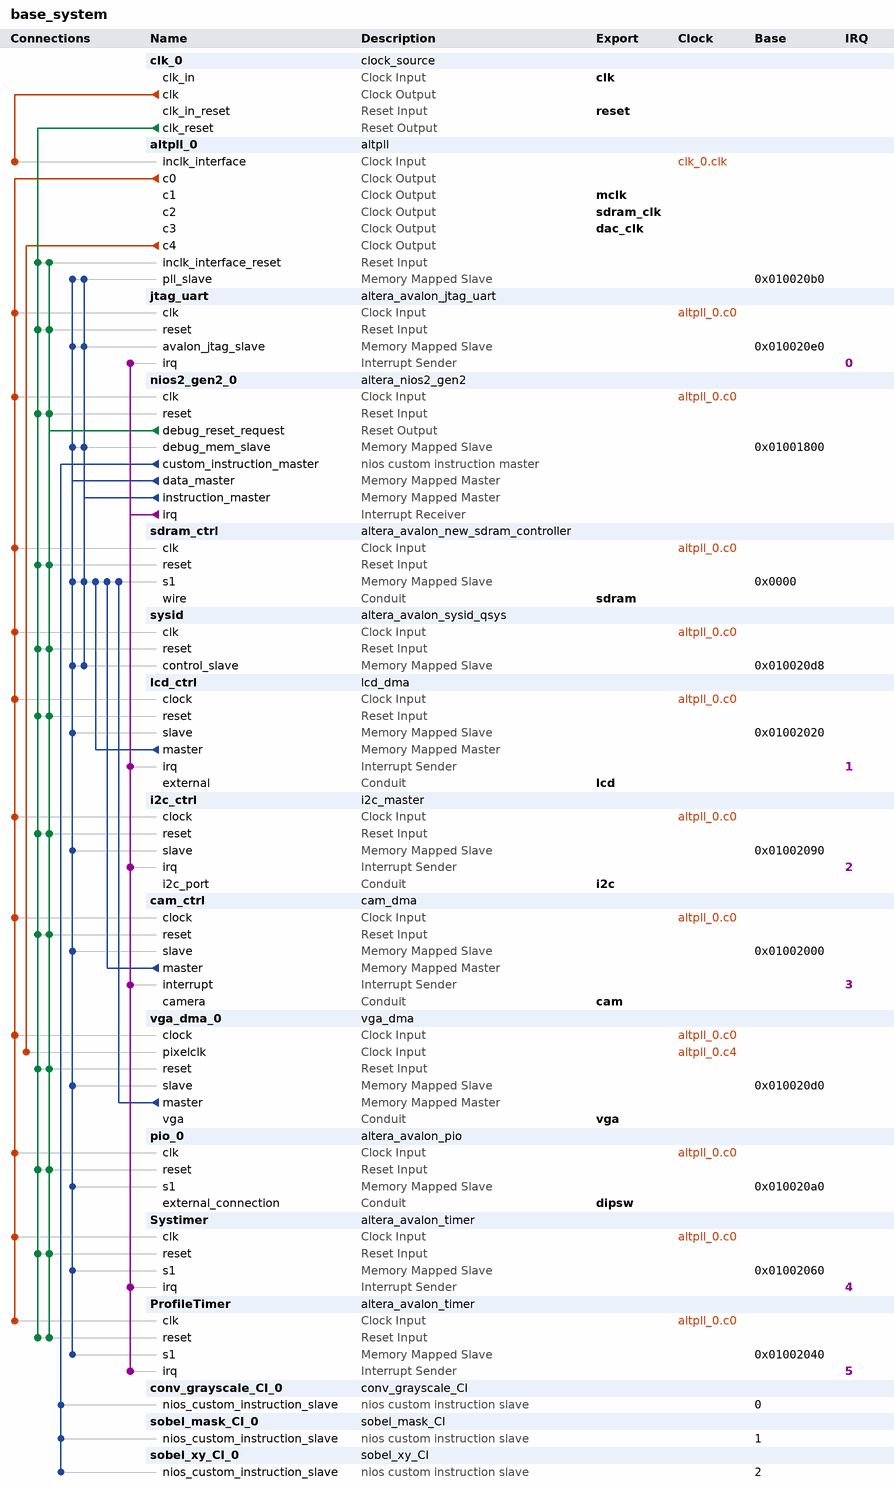
[diagram p0: system contents]
# Platform Designer (Qsys) system base_system, Cyclone IV E EP4CE30F23C7
# Parameters at their usual value, and those the tool derives, are not listed.
package require -exact qsys 18.1
create_system base_system
set_project_property DEVICE_FAMILY {Cyclone IV E}
set_project_property DEVICE EP4CE30F23C7

add_instance clk_0 clock_source 18.1
set_instance_parameter_value clk_0 clockFrequency 50000000

add_instance altpll_0 altpll 18.1
set_instance_parameter_value altpll_0 CLK0_DIVIDE_BY 1
set_instance_parameter_value altpll_0 CLK0_MULTIPLY_BY 1
set_instance_parameter_value altpll_0 CLK1_DIVIDE_BY 25
set_instance_parameter_value altpll_0 CLK1_DUTY_CYCLE 50
set_instance_parameter_value altpll_0 CLK1_MULTIPLY_BY 8
set_instance_parameter_value altpll_0 CLK1_PHASE_SHIFT 0
set_instance_parameter_value altpll_0 CLK2_DIVIDE_BY 1
set_instance_parameter_value altpll_0 CLK2_DUTY_CYCLE 50
set_instance_parameter_value altpll_0 CLK2_MULTIPLY_BY 1
set_instance_parameter_value altpll_0 CLK2_PHASE_SHIFT 0
set_instance_parameter_value altpll_0 CLK3_DIVIDE_BY 2
set_instance_parameter_value altpll_0 CLK3_DUTY_CYCLE 50
set_instance_parameter_value altpll_0 CLK3_MULTIPLY_BY 3
set_instance_parameter_value altpll_0 CLK3_PHASE_SHIFT 0
set_instance_parameter_value altpll_0 CLK4_DIVIDE_BY 2
set_instance_parameter_value altpll_0 CLK4_DUTY_CYCLE 50
set_instance_parameter_value altpll_0 CLK4_MULTIPLY_BY 3
set_instance_parameter_value altpll_0 CLK4_PHASE_SHIFT 0
set_instance_parameter_value altpll_0 INCLK0_INPUT_FREQUENCY 20000
set_instance_parameter_value altpll_0 PORT_ARESET PORT_UNUSED
set_instance_parameter_value altpll_0 PORT_LOCKED PORT_UNUSED
set_instance_parameter_value altpll_0 PORT_clk1 PORT_USED
set_instance_parameter_value altpll_0 PORT_clk2 PORT_USED
set_instance_parameter_value altpll_0 PORT_clk3 PORT_USED
set_instance_parameter_value altpll_0 PORT_clk4 PORT_USED

add_instance jtag_uart altera_avalon_jtag_uart 18.1
set_instance_parameter_value jtag_uart simInteractiveOptions NO_INTERACTIVE_WINDOWS

add_instance nios2_gen2_0 altera_nios2_gen2 18.1
set_instance_parameter_value nios2_gen2_0 dcache_bursts true
set_instance_parameter_value nios2_gen2_0 dcache_size 32768
set_instance_parameter_value nios2_gen2_0 exceptionSlave sdram_ctrl.s1
set_instance_parameter_value nios2_gen2_0 icache_burstType Sequential
set_instance_parameter_value nios2_gen2_0 icache_size 4096
set_instance_parameter_value nios2_gen2_0 impl Fast
set_instance_parameter_value nios2_gen2_0 resetSlave sdram_ctrl.s1
set_instance_parameter_value nios2_gen2_0 setting_bhtPtrSz 12

add_instance sdram_ctrl altera_avalon_new_sdram_controller 18.1
set_instance_parameter_value sdram_ctrl TAC 5.5
set_instance_parameter_value sdram_ctrl TRCD 20.0
set_instance_parameter_value sdram_ctrl TRP 20.0
set_instance_parameter_value sdram_ctrl casLatency 3
set_instance_parameter_value sdram_ctrl columnWidth 9
set_instance_parameter_value sdram_ctrl dataWidth 16
set_instance_parameter_value sdram_ctrl generateSimulationModel false
set_instance_parameter_value sdram_ctrl model single_Micron_MT48LC4M32B2_7_chip
set_instance_parameter_value sdram_ctrl numberOfBanks 4
set_instance_parameter_value sdram_ctrl numberOfChipSelects 1
set_instance_parameter_value sdram_ctrl powerUpDelay 100.0
set_instance_parameter_value sdram_ctrl refreshPeriod 15.625
set_instance_parameter_value sdram_ctrl rowWidth 12

add_instance sysid altera_avalon_sysid_qsys 18.1
set_instance_parameter_value sysid id 0

add_instance lcd_ctrl lcd_dma 1.0

add_instance i2c_ctrl i2c_master 1.0

add_instance cam_ctrl cam_dma 1.0

add_instance vga_dma_0 vga_dma 1.0

add_instance pio_0 altera_avalon_pio 18.1
set_instance_parameter_value pio_0 direction Input
set_instance_parameter_value pio_0 width 8

add_instance Systimer altera_avalon_timer 18.1
set_instance_parameter_value Systimer period 1
set_instance_parameter_value Systimer periodUnits MSEC

add_instance ProfileTimer altera_avalon_timer 18.1
set_instance_parameter_value ProfileTimer period 1
set_instance_parameter_value ProfileTimer periodUnits MSEC

add_instance conv_grayscale_CI_0 conv_grayscale_CI 1.0

add_instance sobel_mask_CI_0 sobel_mask_CI 1.0

add_instance sobel_xy_CI_0 sobel_xy_CI 1.0

# connections
add_connection altpll_0.c0 cam_ctrl.clock clock
add_connection altpll_0.c0 i2c_ctrl.clock clock
add_connection altpll_0.c0 jtag_uart.clk clock
add_connection altpll_0.c0 lcd_ctrl.clock clock
add_connection altpll_0.c0 nios2_gen2_0.clk clock
add_connection altpll_0.c0 pio_0.clk clock
add_connection altpll_0.c0 ProfileTimer.clk clock
add_connection altpll_0.c0 sdram_ctrl.clk clock
add_connection altpll_0.c0 sysid.clk clock
add_connection altpll_0.c0 Systimer.clk clock
add_connection altpll_0.c0 vga_dma_0.clock clock
add_connection altpll_0.c4 vga_dma_0.pixelclk clock
add_connection clk_0.clk altpll_0.inclk_interface clock
add_connection clk_0.clk_reset altpll_0.inclk_interface_reset reset
add_connection clk_0.clk_reset cam_ctrl.reset reset
add_connection clk_0.clk_reset i2c_ctrl.reset reset
add_connection clk_0.clk_reset jtag_uart.reset reset
add_connection clk_0.clk_reset lcd_ctrl.reset reset
add_connection clk_0.clk_reset nios2_gen2_0.reset reset
add_connection clk_0.clk_reset pio_0.reset reset
add_connection clk_0.clk_reset ProfileTimer.reset reset
add_connection clk_0.clk_reset sdram_ctrl.reset reset
add_connection clk_0.clk_reset sysid.reset reset
add_connection clk_0.clk_reset Systimer.reset reset
add_connection clk_0.clk_reset vga_dma_0.reset reset
add_connection nios2_gen2_0.debug_reset_request altpll_0.inclk_interface_reset reset
add_connection nios2_gen2_0.debug_reset_request cam_ctrl.reset reset
add_connection nios2_gen2_0.debug_reset_request i2c_ctrl.reset reset
add_connection nios2_gen2_0.debug_reset_request jtag_uart.reset reset
add_connection nios2_gen2_0.debug_reset_request lcd_ctrl.reset reset
add_connection nios2_gen2_0.debug_reset_request nios2_gen2_0.reset reset
add_connection nios2_gen2_0.debug_reset_request pio_0.reset reset
add_connection nios2_gen2_0.debug_reset_request ProfileTimer.reset reset
add_connection nios2_gen2_0.debug_reset_request sdram_ctrl.reset reset
add_connection nios2_gen2_0.debug_reset_request sysid.reset reset
add_connection nios2_gen2_0.debug_reset_request Systimer.reset reset
add_connection nios2_gen2_0.debug_reset_request vga_dma_0.reset reset
add_connection cam_ctrl.master sdram_ctrl.s1 avalon
set_connection_parameter_value cam_ctrl.master/sdram_ctrl.s1 baseAddress 0x0000
add_connection lcd_ctrl.master sdram_ctrl.s1 avalon
set_connection_parameter_value lcd_ctrl.master/sdram_ctrl.s1 baseAddress 0x0000
add_connection nios2_gen2_0.data_master altpll_0.pll_slave avalon
set_connection_parameter_value nios2_gen2_0.data_master/altpll_0.pll_slave baseAddress 0x010020b0
add_connection nios2_gen2_0.data_master cam_ctrl.slave avalon
set_connection_parameter_value nios2_gen2_0.data_master/cam_ctrl.slave baseAddress 0x01002000
add_connection nios2_gen2_0.data_master i2c_ctrl.slave avalon
set_connection_parameter_value nios2_gen2_0.data_master/i2c_ctrl.slave baseAddress 0x01002090
add_connection nios2_gen2_0.data_master jtag_uart.avalon_jtag_slave avalon
set_connection_parameter_value nios2_gen2_0.data_master/jtag_uart.avalon_jtag_slave baseAddress 0x010020e0
add_connection nios2_gen2_0.data_master lcd_ctrl.slave avalon
set_connection_parameter_value nios2_gen2_0.data_master/lcd_ctrl.slave baseAddress 0x01002020
add_connection nios2_gen2_0.data_master nios2_gen2_0.debug_mem_slave avalon
set_connection_parameter_value nios2_gen2_0.data_master/nios2_gen2_0.debug_mem_slave baseAddress 0x01001800
add_connection nios2_gen2_0.data_master pio_0.s1 avalon
set_connection_parameter_value nios2_gen2_0.data_master/pio_0.s1 baseAddress 0x010020a0
add_connection nios2_gen2_0.data_master ProfileTimer.s1 avalon
set_connection_parameter_value nios2_gen2_0.data_master/ProfileTimer.s1 baseAddress 0x01002040
add_connection nios2_gen2_0.data_master sdram_ctrl.s1 avalon
set_connection_parameter_value nios2_gen2_0.data_master/sdram_ctrl.s1 baseAddress 0x0000
add_connection nios2_gen2_0.data_master sysid.control_slave avalon
set_connection_parameter_value nios2_gen2_0.data_master/sysid.control_slave baseAddress 0x010020d8
add_connection nios2_gen2_0.data_master Systimer.s1 avalon
set_connection_parameter_value nios2_gen2_0.data_master/Systimer.s1 baseAddress 0x01002060
add_connection nios2_gen2_0.data_master vga_dma_0.slave avalon
set_connection_parameter_value nios2_gen2_0.data_master/vga_dma_0.slave baseAddress 0x010020d0
add_connection nios2_gen2_0.instruction_master altpll_0.pll_slave avalon
set_connection_parameter_value nios2_gen2_0.instruction_master/altpll_0.pll_slave baseAddress 0x010020b0
add_connection nios2_gen2_0.instruction_master jtag_uart.avalon_jtag_slave avalon
set_connection_parameter_value nios2_gen2_0.instruction_master/jtag_uart.avalon_jtag_slave baseAddress 0x010020e0
add_connection nios2_gen2_0.instruction_master nios2_gen2_0.debug_mem_slave avalon
set_connection_parameter_value nios2_gen2_0.instruction_master/nios2_gen2_0.debug_mem_slave baseAddress 0x01001800
add_connection nios2_gen2_0.instruction_master sdram_ctrl.s1 avalon
set_connection_parameter_value nios2_gen2_0.instruction_master/sdram_ctrl.s1 baseAddress 0x0000
add_connection nios2_gen2_0.instruction_master sysid.control_slave avalon
set_connection_parameter_value nios2_gen2_0.instruction_master/sysid.control_slave baseAddress 0x010020d8
add_connection vga_dma_0.master sdram_ctrl.s1 avalon
set_connection_parameter_value vga_dma_0.master/sdram_ctrl.s1 baseAddress 0x0000
add_connection nios2_gen2_0.irq cam_ctrl.interrupt interrupt
set_connection_parameter_value nios2_gen2_0.irq/cam_ctrl.interrupt irqNumber 3
add_connection nios2_gen2_0.irq i2c_ctrl.irq interrupt
set_connection_parameter_value nios2_gen2_0.irq/i2c_ctrl.irq irqNumber 2
add_connection nios2_gen2_0.irq jtag_uart.irq interrupt
set_connection_parameter_value nios2_gen2_0.irq/jtag_uart.irq irqNumber 0
add_connection nios2_gen2_0.irq lcd_ctrl.irq interrupt
set_connection_parameter_value nios2_gen2_0.irq/lcd_ctrl.irq irqNumber 1
add_connection nios2_gen2_0.irq ProfileTimer.irq interrupt
set_connection_parameter_value nios2_gen2_0.irq/ProfileTimer.irq irqNumber 5
add_connection nios2_gen2_0.irq Systimer.irq interrupt
set_connection_parameter_value nios2_gen2_0.irq/Systimer.irq irqNumber 4
add_connection nios2_gen2_0.custom_instruction_master conv_grayscale_CI_0.nios_custom_instruction_slave nios_custom_instruction
set_connection_parameter_value nios2_gen2_0.custom_instruction_master/conv_grayscale_CI_0.nios_custom_instruction_slave CIName conv_grayscale_ci_0
set_connection_parameter_value nios2_gen2_0.custom_instruction_master/conv_grayscale_CI_0.nios_custom_instruction_slave baseAddress 0
add_connection nios2_gen2_0.custom_instruction_master sobel_mask_CI_0.nios_custom_instruction_slave nios_custom_instruction
set_connection_parameter_value nios2_gen2_0.custom_instruction_master/sobel_mask_CI_0.nios_custom_instruction_slave CIName sobel_mask_ci_0
set_connection_parameter_value nios2_gen2_0.custom_instruction_master/sobel_mask_CI_0.nios_custom_instruction_slave baseAddress 1
add_connection nios2_gen2_0.custom_instruction_master sobel_xy_CI_0.nios_custom_instruction_slave nios_custom_instruction
set_connection_parameter_value nios2_gen2_0.custom_instruction_master/sobel_xy_CI_0.nios_custom_instruction_slave CIName sobel_xy_ci_0
set_connection_parameter_value nios2_gen2_0.custom_instruction_master/sobel_xy_CI_0.nios_custom_instruction_slave baseAddress 2

# exported interfaces
add_interface cam conduit end
set_interface_property cam EXPORT_OF cam_ctrl.camera
add_interface clk clock sink
set_interface_property clk EXPORT_OF clk_0.clk_in
add_interface dac_clk clock source
set_interface_property dac_clk EXPORT_OF altpll_0.c3
add_interface dipsw conduit end
set_interface_property dipsw EXPORT_OF pio_0.external_connection
add_interface i2c conduit end
set_interface_property i2c EXPORT_OF i2c_ctrl.i2c_port
add_interface lcd conduit end
set_interface_property lcd EXPORT_OF lcd_ctrl.external
add_interface mclk clock source
set_interface_property mclk EXPORT_OF altpll_0.c1
add_interface reset reset sink
set_interface_property reset EXPORT_OF clk_0.clk_in_reset
add_interface sdram conduit end
set_interface_property sdram EXPORT_OF sdram_ctrl.wire
add_interface sdram_clk clock source
set_interface_property sdram_clk EXPORT_OF altpll_0.c2
add_interface vga conduit end
set_interface_property vga EXPORT_OF vga_dma_0.vga

set_interconnect_requirement {$system} qsys_mm.clockCrossingAdapter HANDSHAKE
set_interconnect_requirement {$system} qsys_mm.enableEccProtection FALSE
set_interconnect_requirement {$system} qsys_mm.insertDefaultSlave FALSE
set_interconnect_requirement {$system} qsys_mm.maxAdditionalLatency 1

save_system base_system.qsys
